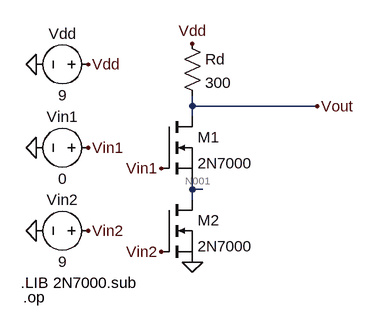
[diagram p0: schematic PreLab1.asc]
PreLab1.asc, the LTspice schematic file:
Version 4
SHEET 1 880 680
WIRE 192 -96 192 -112
WIRE 384 -96 192 -96
WIRE 192 -80 192 -96
WIRE 192 32 192 16
WIRE 208 32 192 32
WIRE 192 48 192 32
FLAG -48 96 0
FLAG -48 -32 0
FLAG -48 -160 0
FLAG 32 -160 Vdd
FLAG 32 -32 Vin1
FLAG 32 96 Vin2
FLAG 144 0 Vin1
FLAG 144 128 Vin2
FLAG 384 -96 Vout
FLAG 192 -192 Vdd
FLAG 192 144 0
DATAFLAG 304 -96 ""
DATAFLAG 208 32 ""
SYMBOL voltage 48 -160 R90
WINDOW 0 -32 56 VBottom 2
WINDOW 3 32 56 VTop 2
WINDOW 123 0 0 Left 0
WINDOW 39 0 0 Left 0
SYMATTR InstName Vdd
SYMATTR Value 9
SYMBOL voltage 48 -32 R90
WINDOW 0 -32 56 VBottom 2
WINDOW 3 32 56 VTop 2
WINDOW 123 0 0 Left 0
WINDOW 39 0 0 Left 0
SYMATTR InstName Vin1
SYMATTR Value 0
SYMBOL voltage 48 96 R90
WINDOW 0 -32 56 VBottom 2
WINDOW 3 32 56 VTop 2
WINDOW 123 0 0 Left 0
WINDOW 39 0 0 Left 0
SYMATTR InstName Vin2
SYMATTR Value 9
SYMBOL res 176 -208 R0
SYMATTR InstName Rd
SYMATTR Value 300
SYMBOL nmos 144 -80 R0
SYMATTR InstName M1
SYMATTR Value 2N7000
SYMBOL nmos 144 48 R0
SYMATTR InstName M2
SYMATTR Value 2N7000
TEXT -68 198 Left 2 !.op
TEXT -72 176 Left 2 !.LIB 2N7000.sub

The netlist it stands for:
* PreLab1.asc
Vdd Vdd 0 9
Vin1 Vin1 0 0
Vin2 Vin2 0 9
Rd Vdd Vout 300
M1 Vout Vin1 N001 N001 2N7000
M2 N001 Vin2 0 0 2N7000
.model NMOS NMOS
.model PMOS PMOS
.lib standard.mos
.op
.LIB 2N7000.sub
.backanno
.end

* Results of the author's LTspice run, read from the files saved beside the schematic
* Operating Point:
*   V(vdd) = 9 V
*   V(vin1) = 0 V
*   V(vin2) = 9 V
*   V(vout) = 9 V
*   V(n001) = 34.6 pV
*   Id(M2) = 18.01 pA
*   Ig(M2) = 0 A
*   Ib(M2) = 0 A
*   Is(M2) = -18.01 pA
*   Id(M1) = 18.01 pA
*   Ig(M1) = 0 A
*   Ib(M1) = -9.01 pA
*   Is(M1) = -9 pA
*   I(Rd) = 18.01 pA
*   I(Vin2) = 0 A
*   I(Vin1) = 0 A
*   I(Vdd) = -18.01 pA
* From the log:
*   Semiconductor Device Operating Points:
*                           --- MOSFET Transistors ---
*   Name:          m2          m1
*   Model:       2n7000      2n7000
*   Id:          1.80e-11    1.80e-11
*   Vgs:         9.00e+00   -3.46e-11
*   Vds:         3.46e-11    9.00e+00
*   Vbs:         0.00e+00    0.00e+00
*   Vth:         1.95e+00    1.92e+00
*   Vdsat:       6.20e+00    3.59e-02
*   Gm:          2.54e-12    5.86e-24
*   Gds:         6.77e-01    1.98e-26
*   Gmb:         5.24e-13    3.23e-24
*   Cbd:         0.00e+00    0.00e+00
*   Cbs:         0.00e+00    0.00e+00
*   Cgsov:       7.27e-11    7.27e-11
*   Cgdov:       2.54e-11    2.54e-11
*   Cgbov:       0.00e+00    0.00e+00
*   Cgs:         3.45e-12    0.00e+00
*   Cgd:         3.45e-12    0.00e+00
*   Cgb:         0.00e+00    6.90e-12